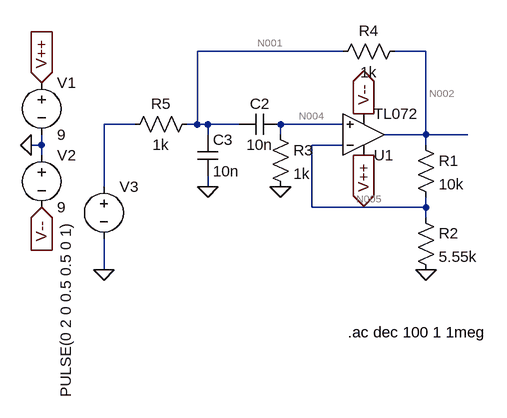
[diagram p0: schematic BandPassSKSecondOrder.asc]
BandPassSKSecondOrder.asc, the LTspice schematic file:
Version 4
SHEET 1 880 680
WIRE 592 96 368 96
WIRE 720 96 672 96
WIRE 272 208 224 208
WIRE 368 208 368 96
WIRE 368 208 352 208
WIRE 384 208 368 208
WIRE 432 208 384 208
WIRE 592 208 496 208
WIRE 384 224 384 208
WIRE 496 224 496 208
WIRE 720 224 720 96
WIRE 720 224 656 224
WIRE 784 224 720 224
WIRE 128 240 128 224
WIRE 128 240 112 240
WIRE 592 240 544 240
WIRE 720 240 720 224
WIRE 128 256 128 240
WIRE 224 304 224 208
WIRE 384 304 384 288
WIRE 544 336 544 240
WIRE 720 336 720 320
WIRE 720 336 544 336
WIRE 720 352 720 336
WIRE 224 432 224 384
FLAG 112 240 0
FLAG 128 144 V++
IOPIN 128 144 In
FLAG 128 336 V--
IOPIN 128 336 In
FLAG 224 432 0
FLAG 624 192 V--
IOPIN 624 192 Out
FLAG 624 256 V++
IOPIN 624 256 Out
FLAG 720 432 0
FLAG 384 304 0
FLAG 496 304 0
SYMBOL Voltage 128 128 R0
SYMATTR InstName V1
SYMATTR Value 9
SYMBOL Voltage 128 240 R0
SYMATTR InstName V2
SYMATTR Value 9
SYMBOL Voltage 224 288 R0
WINDOW 3 -59 70 VRight 2
SYMATTR Value PULSE(0 2 0 0.5 0.5 0 1)
SYMATTR InstName V3
SYMATTR Value2 AC 1
SYMBOL OpAmps/TL072 624 288 M180
SYMATTR InstName U1
SYMBOL Res 704 224 R0
SYMATTR InstName R1
SYMATTR Value 10k
SYMBOL Res 704 336 R0
SYMATTR InstName R2
SYMATTR Value 5.55k
SYMBOL Res 688 80 R90
WINDOW 0 0 56 VBottom 2
WINDOW 3 32 56 VTop 2
SYMATTR InstName R4
SYMATTR Value 1k
SYMBOL Res 368 192 R90
WINDOW 0 0 56 VBottom 2
WINDOW 3 32 56 VTop 2
SYMATTR InstName R5
SYMATTR Value 1k
SYMBOL Cap 496 192 R90
WINDOW 0 0 32 VBottom 2
WINDOW 3 32 32 VTop 2
SYMATTR InstName C2
SYMATTR Value 10n
SYMBOL Cap 368 224 R0
SYMATTR InstName C3
SYMATTR Value 10n
SYMBOL Res 480 208 R0
SYMATTR InstName R3
SYMATTR Value 1k
TEXT 600 528 Left 2 !.ac dec 100 1 1meg

The netlist it stands for:
* BandPassSKSecondOrder.asc
V1 V++ 0 9
V2 0 V-- 9
V3 N003 0 PULSE(0 2 0 0.5 0.5 0 1) AC 1
XU1 N004 N005 V++ V-- N002 TL072  ; pins In+ In- V+ V- OUT
R1 N002 N005 10k
R2 N005 0 5.55k
R4 N002 N001 1k
R5 N001 N003 1k
C2 N004 N001 10n
C3 N001 0 10n
R3 N004 0 1k
.ac dec 100 1 1meg
.backanno
.end

* Results of the author's LTspice run, read from the files saved beside the schematic
* Operating Point, zero values left out:
*   V(v++) = 9 V
*   V(v--) = -9 V
*   V(n002) = 31.02 µV
*   V(n005) = 10.93 µV
*   V(n004) = -39.05 nV
*   V(n001) = 15.51 µV
*   I(R1) = 2.009 nA
*   I(R2) = 1.97 nA
*   I(R4) = 15.51 nA
*   I(R5) = 15.51 nA
*   I(R3) = -39.05 pA
*   I(V1) = -8.594 mA
*   I(V2) = -8.595 mA
*   I(V3) = 15.51 nA
*   Ix(u1:1) = 39.05 pA
*   Ix(u1:2) = 39.05 pA
*   Ix(u1:3) = 8.594 mA
*   Ix(u1:4) = -8.595 mA
*   Ix(u1:5) = -17.52 nA
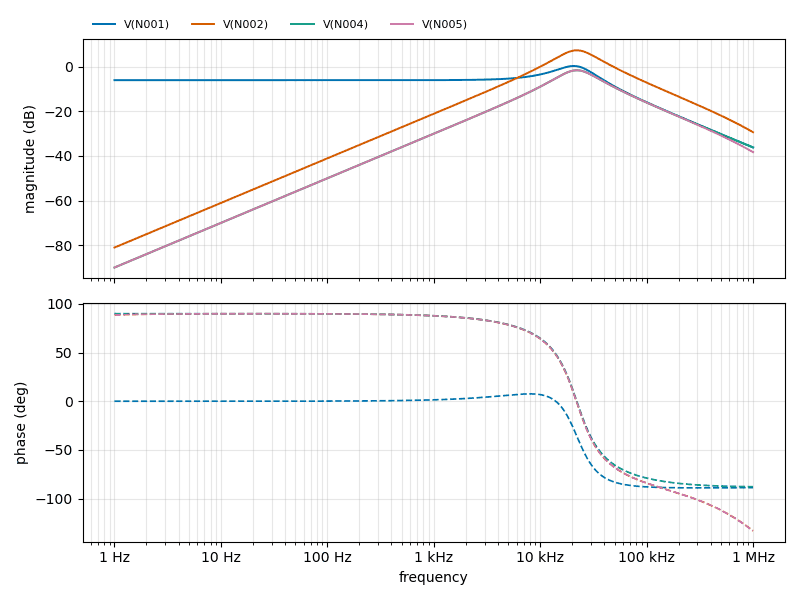
[diagram p1: AC Analysis of BandPassSKSecondOrder.asc, plotted from the saved traces]
* AC Analysis, 1 run:
*   V(N001): -6.02 dB at 1 Hz, -36.18 dB at 1 MHz, peak 0.35 dB at 20.89 kHz, 3 dB below the peak at 11.69 kHz and 30.55 kHz
*   V(N002): -81.10 dB at 1 Hz, -29.36 dB at 1 MHz, peak 7.39 dB at 21.88 kHz, 3 dB below the peak at 14.73 kHz and 33.04 kHz
*   V(N004): -90.06 dB at 1 Hz, -36.18 dB at 1 MHz, peak -1.57 dB at 21.88 kHz, 3 dB below the peak at 14.73 kHz and 33.05 kHz
*   V(N005): -90.05 dB at 1 Hz, -38.31 dB at 1 MHz, peak -1.56 dB at 21.88 kHz, 3 dB below the peak at 14.73 kHz and 33.04 kHz